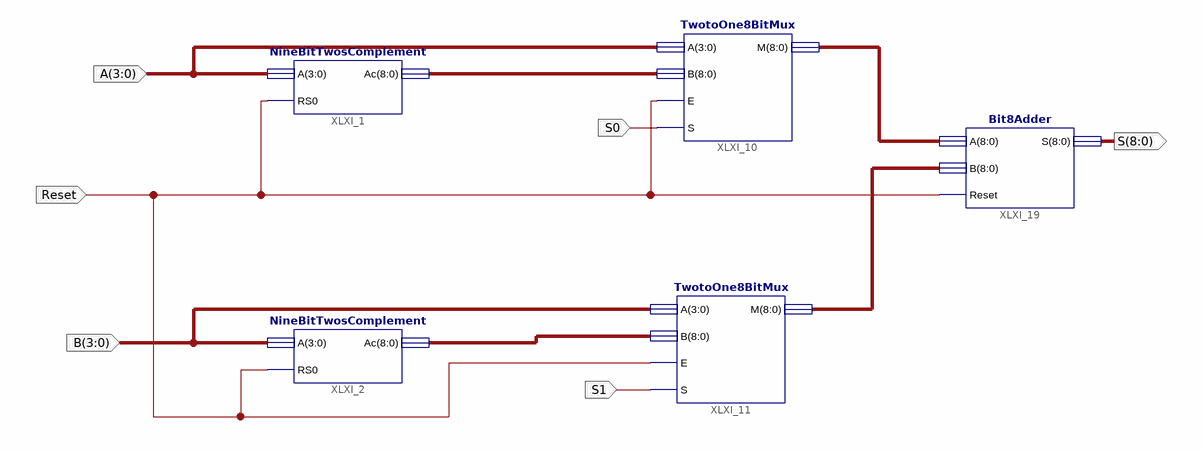
[diagram p0: schematic sheet 1]
// Xilinx ISE schematic SignAdder.sch (artix7) as structural Verilog: 5 symbols, 6 ports
module SignAdder (
  input  [3:0] A,
  input  [3:0] B,
  input  S0,
  input  S1,
  input  Reset,
  output [8:0] S
);

  wire [8:0] XLXN_1, XLXN_4, XLXN_16, XLXN_17;

  NineBitTwosComplement XLXI_1 (.A(A), .RS0(Reset), .Ac(XLXN_1));
  NineBitTwosComplement XLXI_2 (.A(B), .RS0(Reset), .Ac(XLXN_4));
  TwotoOne8BitMux XLXI_10 (.A(A), .B(XLXN_1), .E(Reset), .M(XLXN_16), .S(S0));
  TwotoOne8BitMux XLXI_11 (.A(B), .B(XLXN_4), .E(Reset), .M(XLXN_17), .S(S1));
  Bit8Adder XLXI_19 (.A(XLXN_16), .B(XLXN_17), .Reset(Reset), .S(S));
endmodule
